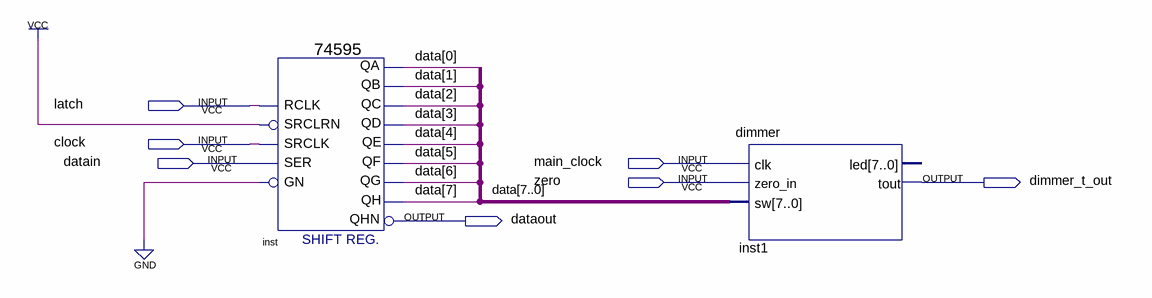
[diagram p0: schematic sheet]
// Quartus schematic dimmer595.bdf as structural Verilog: 2 symbols, 7 pins
module dimmer595 (
  input  latch,
  input  clock,
  input  datain,
  input  main_clock,
  input  zero,
  output dimmer_t_out,
  output dataout
);

  wire [7:0] data;

  \74595  inst (
    .RCLK(latch), .SRCLRN(1'b1), .SRCLK(clock), .SER(datain), .GN(1'b0), .QHN(dataout), .QH(data[7]),
    .QG(data[6]), .QF(data[5]), .QE(data[4]), .QC(data[2]), .QD(data[3]), .QA(data[0]), .QB(data[1]));
  dimmer inst1 (.clk(main_clock), .zero_in(zero), .sw(data), .tout(dimmer_t_out));  // open: led
endmodule
